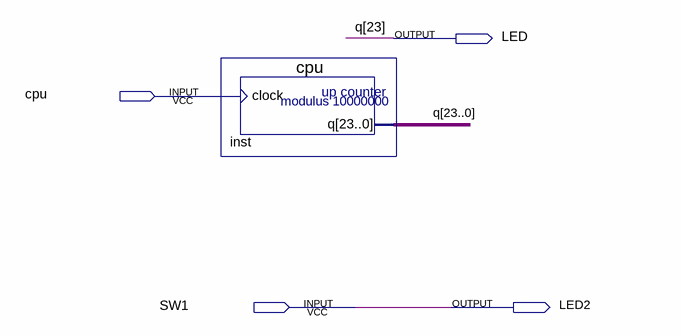
[diagram p0: schematic sheet]
// Quartus schematic clock10MHz.bdf as structural Verilog: 1 symbols, 4 pins
module clock10MHz (
  input  cpu,
  input  SW1,
  output LED,
  output LED2
);

  wire [22:0] q;

  cpu inst (.clock(cpu), .q({LED, q}));

  assign LED2 = SW1;

  // Other names for the same wires on the sheet: q[23] = LED
endmodule
